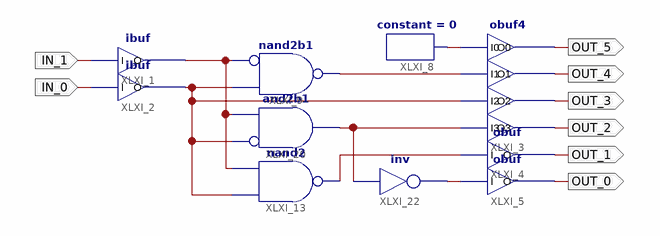
[diagram p0: schematic sheet 1]
// Xilinx ISE schematic Decoder2To6.sch (spartan3a) as structural Verilog: 10 symbols, 8 ports
module Decoder2To6 (
  input  IN_1,
  input  IN_0,
  output OUT_5,
  output OUT_4,
  output OUT_3,
  output OUT_2,
  output OUT_1,
  output OUT_0
);

  wire XLXN_11, XLXN_12, XLXN_16, XLXN_17, XLXN_36, XLXN_41, XLXN_51;

  obuf4 XLXI_3 (.I0(XLXN_11), .I1(XLXN_12), .I2(XLXN_17), .I3(XLXN_41), .O0(OUT_5), .O1(OUT_4), .O2(OUT_3), .O3(OUT_2));
  obuf XLXI_4 (.I(XLXN_36), .O(OUT_1));
  obuf XLXI_5 (.I(XLXN_51), .O(OUT_0));
  constant #(.CValue("0")) XLXI_8 (.O(XLXN_11));
  nand XLXI_13 (XLXN_36, XLXN_17, XLXN_16);
  ibuf XLXI_2 (.I(IN_0), .O(XLXN_17));
  ibuf XLXI_1 (.I(IN_1), .O(XLXN_16));
  nand XLXI_9 (XLXN_12, ~XLXN_16, XLXN_17);  // nand2b1
  and XLXI_20 (XLXN_41, ~XLXN_17, XLXN_16);  // and2b1
  not XLXI_22 (XLXN_51, XLXN_41);
endmodule
